# EAGLE schematic Lamp Logic Board_11 (EAGLE 9.5.0)

## Sheet 1 of 4
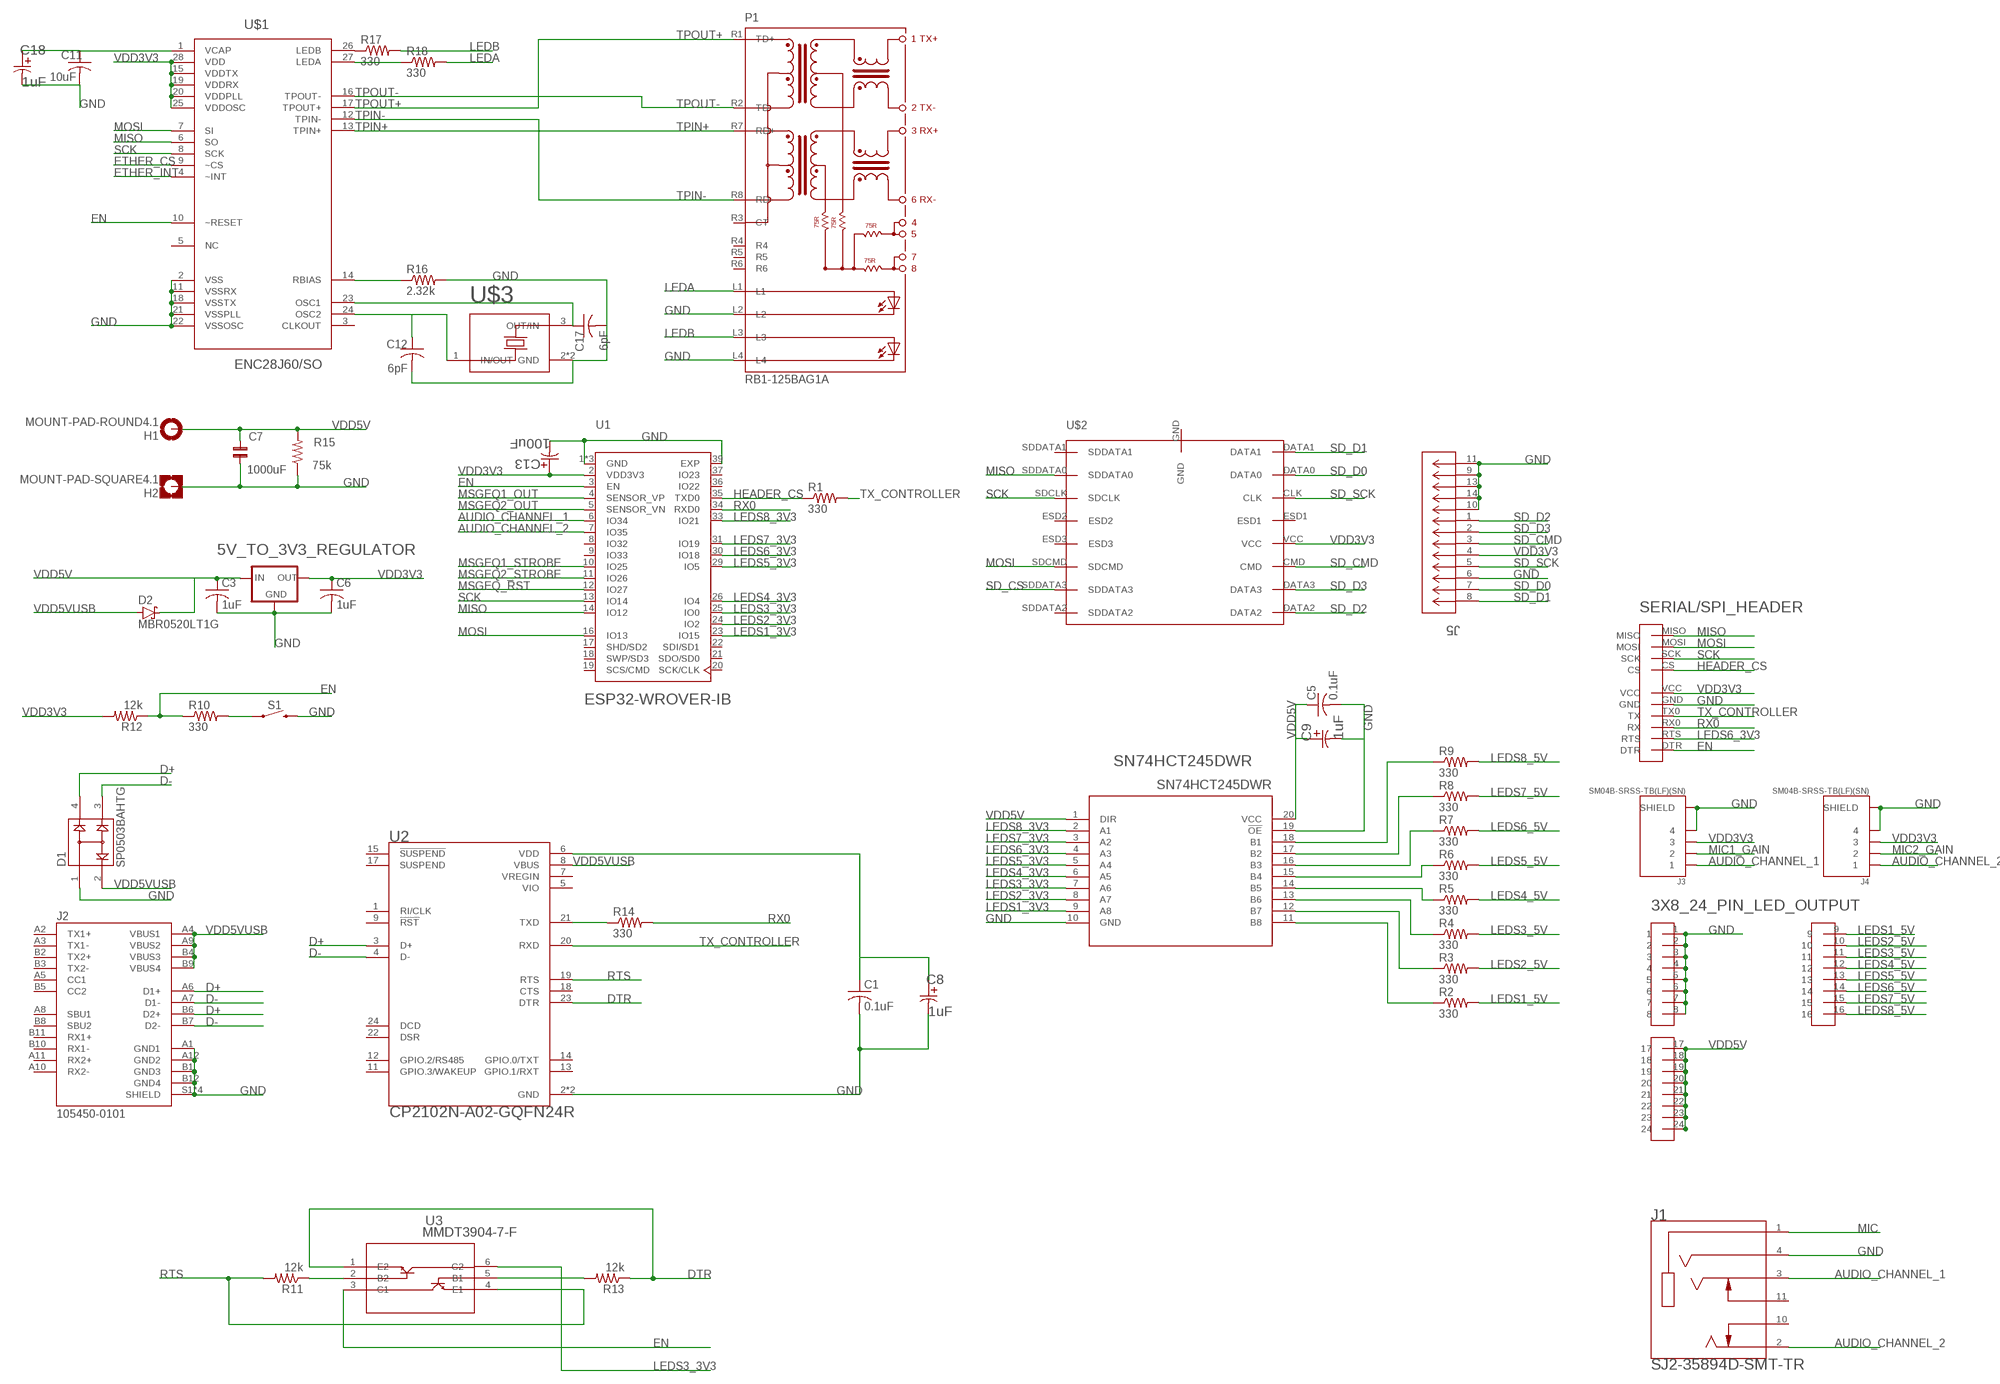
[diagram p0: schematic, sheet 1]

### Parts
3X8_24_PIN_LED_OUTPUT  3X8PINHEAD  [3X8PINHEAD]
5V_TO_3V3_REGULATOR  LM1117MP-1.8  [SOT223]
C1  0.1uF  C-USC0402  [C0402]
C3  1uF  C-USC0402  [C0402]
C5  0.1uF  C-USC0805  [C0805]
C6  1uF  C-USC0402  [C0402]
C7  1000uF  C-BP-2,0X5  [ENP2,0-5]
C8  1uF  EEEFC1V1R0R  [CAP_EEFC_B]
C9  1uF  EEEFC1V1R0R  [CAP_EEFC_B]
C11  10uF  C-USC0402  [C0402]
C12  6pF  C-USC0402  [C0402]
C13  100uF  EEEFC1V1R0R  [CAP_EEFC_B]
C17  6pF  C-USC0402  [C0402]
C18  1uF  EEEFC1V1R0R  [CAP_EEFC_B]
D1  SP0503BAHTG  [SOT143]
D2  MBR0520LT1G  [SOD-123]
H1  MOUNT-PAD-ROUND4.1  [4,1-PAD]
H2  MOUNT-PAD-SQUARE4.1  [4,1-PAD-SQUARE]
J1  SJ2-35894D-SMT-TR  [CUI_SJ2-35894D-SMT-TR]
J2  105450-0101  [MOLEX_105450-0101]
J3  SM04B-SRSS-TB(LF)(SN)  [JST_SM04B-SRSS-TB(LF)(SN)]
J4  SM04B-SRSS-TB(LF)(SN)  [JST_SM04B-SRSS-TB(LF)(SN)]
J5  LLC  [CON00218_8]
P1  RB1-125BAG1A  [WIZNET_RB1-125BAG1A]
R1  330  R-US_R1206  [R1206]
R2  330  R-US_R1206  [R1206]
R3  330  R-US_R1206  [R1206]
R4  330  R-US_R1206  [R1206]
R5  330  R-US_R1206  [R1206]
R6  330  R-US_R1206  [R1206]
R7  330  R-US_R1206  [R1206]
R8  330  R-US_R1206  [R1206]
R9  330  R-US_R1206  [R1206]
R10  330  R-US_R1206  [R1206]
R11  12k  R-US_R1206  [R1206]
R12  12k  R-US_R1206  [R1206]
R13  12k  R-US_R1206  [R1206]
R14  330  R-US_R1206  [R1206]
R15  75k  R-US_0309/12  [0309/12]
R16  2.32k  R-US_R1206  [R1206]
R17  330  R-US_R1206  [R1206]
R18  330  R-US_R1206  [R1206]
S1  MOMENTARY-SWITCH-SPST-SMD-6.0X3.5MM  [TACTILE_SWITCH_SMD_6.0X3.5MM]
SERIAL/SPI_HEADER  2X6PINHEAD  [2X6PINHEAD]
SN74HCT245DWR  SN74HCT245DWR  [DW20]
U1  ESP32-WROVER-IB  ESP32-WROVER-I  [XCVR_ESP32-WROVER-I]
U2  CP2102N-A02-GQFN24R  [SILABS_CP2102N-A02-GQFN24R]
U3  MMDT3904-7-F  [SOT-363]
U$1  ENC28J60/SO  [SOIC127P1034X264-28N]
U$2  CM1624-08DE  [CM1624-08DE]
U$3  ECS-250-10-37B-CTN-TR  [ECS-250-10-37B-CTN-TR]

### Nets
AUDIO_CHANNEL_1: J1.3(RING1) J3.1 U1.6(IO34)
AUDIO_CHANNEL_2: J1.2(TIP) J4.1 U1.7(IO35)
D+: D1.4 J2.A6(D1+) J2.B6(D2+) U2.3(D+)
D-: D1.3 J2.A7(D1-) J2.B7(D2-) U2.4(D-)
DTR: R13.1 U2.23(DTR) U3.1(E2)
EN: R10.1 R12.1 SERIAL/SPI_HEADER.DTR U1.3(EN) U3.3(C1) U$1.10(~RESET)
ETHER_CS: U$1.9(~CS)
ETHER_INT: U$1.4(~INT)
GND: 3X8_24_PIN_LED_OUTPUT.1 3X8_24_PIN_LED_OUTPUT.2 3X8_24_PIN_LED_OUTPUT.3 3X8_24_PIN_LED_OUTPUT.4 3X8_24_PIN_LED_OUTPUT.5 3X8_24_PIN_LED_OUTPUT.6 3X8_24_PIN_LED_OUTPUT.7 3X8_24_PIN_LED_OUTPUT.8 5V_TO_3V3_REGULATOR.1(GND) C1.2 C3.2 C5.2 C6.2 C7.1 C8.2 C9.2 C11.2 C12.2 C13.2 C17.2 C18.2 D1.1 H2.B4,1(MOUNT) J1.4(RING2) J2.A1(GND1) J2.A12(GND2) J2.B1(GND3) J2.B12(GND4) J2.S1(SHIELD) J2.S2(SHIELD) J2.S3(SHIELD) J2.S4(SHIELD) J3.4 J3.S1(SHIELD) J3.S2(SHIELD) J4.4 J4.S1(SHIELD) J4.S2(SHIELD) J5.6 J5.9 J5.10 J5.11 J5.13 J5.14 P1.L2 P1.L4 R15.1 R16.2 S1.2 SERIAL/SPI_HEADER.GND SN74HCT245DWR.10(GND) SN74HCT245DWR.19(!OE) U1.1(GND) U1.15(GND) U1.38(GND) U1.39(EXP) U2.2(GND) U2.25(GND) U$1.2(VSS) U$1.11(VSSRX) U$1.18(VSSTX) U$1.21(VSSPLL) U$1.22(VSSOSC) U$3.2(GND) U$3.4(GND)
HEADER_CS: R1.1 SERIAL/SPI_HEADER.CS U1.35(TXD0)
LEDA: P1.L1 R18.2
LEDB: P1.L3 R17.2
LEDS1_3V3: SN74HCT245DWR.9(A8) U1.23(IO15)
LEDS1_5V: 3X8_24_PIN_LED_OUTPUT.9 R2.2
LEDS2_3V3: SN74HCT245DWR.8(A7) U1.24(IO2)
LEDS2_5V: 3X8_24_PIN_LED_OUTPUT.10 R3.2
LEDS3_3V3: SN74HCT245DWR.7(A6) U1.25(IO0) U3.6(C2)
LEDS3_5V: 3X8_24_PIN_LED_OUTPUT.11 R4.2
LEDS4_3V3: SN74HCT245DWR.6(A5) U1.26(IO4)
LEDS4_5V: 3X8_24_PIN_LED_OUTPUT.12 R5.2
LEDS5_3V3: SN74HCT245DWR.5(A4) U1.29(IO5)
LEDS5_5V: 3X8_24_PIN_LED_OUTPUT.13 R6.2
LEDS6_3V3: SERIAL/SPI_HEADER.RTS SN74HCT245DWR.4(A3) U1.30(IO18)
LEDS6_5V: 3X8_24_PIN_LED_OUTPUT.14 R7.2
LEDS7_3V3: SN74HCT245DWR.3(A2) U1.31(IO19)
LEDS7_5V: 3X8_24_PIN_LED_OUTPUT.15 R8.2
LEDS8_3V3: SN74HCT245DWR.2(A1) U1.33(IO21)
LEDS8_5V: 3X8_24_PIN_LED_OUTPUT.16 R9.2
MIC: J1.1(SLEEVE)
MIC1_GAIN: J3.2
MIC2_GAIN: J4.2
MISO: SERIAL/SPI_HEADER.MISO U1.14(IO12) U$1.6(SO) U$2.SDDATA0
MOSI: SERIAL/SPI_HEADER.MOSI U1.16(IO13) U$1.7(SI) U$2.SDCMD
MSGEQ1_OUT: U1.4(SENSOR_VP)
MSGEQ1_STROBE: U1.10(IO25)
MSGEQ2_OUT: U1.5(SENSOR_VN)
MSGEQ2_STROBE: U1.11(IO26)
MSGEQ_RST: U1.12(IO27)
N$1: R9.1 SN74HCT245DWR.18(B1)
N$5: C1.1 C8.1 U2.6(VDD)
N$6: R8.1 SN74HCT245DWR.17(B2)
N$7: R11.1 U3.2(B2)
N$8: R13.2 U3.5(B1)
N$9: R10.2 S1.1
N$10: R7.1 SN74HCT245DWR.16(B3)
N$11: R6.1 SN74HCT245DWR.15(B4)
N$12: R5.1 SN74HCT245DWR.14(B5)
N$13: R4.1 SN74HCT245DWR.13(B6)
N$14: R3.1 SN74HCT245DWR.12(B7)
N$15: R2.1 SN74HCT245DWR.11(B8)
N$18: R14.1 U2.21(TXD)
N$19: C11.1 C18.1 U$1.1(VCAP)
N$20: R16.1 U$1.14(RBIAS)
N$21: C12.1 U$1.24(OSC2) U$3.1(IN/OUT)
N$22: C17.1 U$1.23(OSC1) U$3.3(OUT/IN)
N$23: R17.1 U$1.26(LEDB)
N$25: R18.1 U$1.27(LEDA)
RTS: R11.2 U2.19(RTS) U3.4(E1)
RX0: R14.2 SERIAL/SPI_HEADER.RX0(RX) U1.34(RXD0)
SCK: SERIAL/SPI_HEADER.SCK U1.13(IO14) U$1.8(SCK) U$2.SDCLK
SD_CMD: J5.3 U$2.CMD
SD_CS: U$2.SDDATA3
SD_D0: J5.7 U$2.DATA0
SD_D1: J5.8 U$2.DATA1
SD_D2: J5.1 U$2.DATA2
SD_D3: J5.2 U$2.DATA3
SD_SCK: J5.5 U$2.CLK
TPIN+: P1.R7(RD+) U$1.13(TPIN+)
TPIN-: P1.R8(RD-) U$1.12(TPIN-)
TPOUT+: P1.R1(TD+) U$1.17(TPOUT+)
TPOUT-: P1.R2(TD-) U$1.16(TPOUT-)
TX_CONTROLLER: R1.2 SERIAL/SPI_HEADER.TX0(TX) U2.20(RXD)
VDD3V3: 5V_TO_3V3_REGULATOR.2(OUT) 5V_TO_3V3_REGULATOR.4(OUT) C6.1 C13.1 J3.3 J4.3 J5.4 R12.2 SERIAL/SPI_HEADER.VCC U1.2(VDD3V3) U$1.15(VDDTX) U$1.19(VDDRX) U$1.20(VDDPLL) U$1.25(VDDOSC) U$1.28(VDD) U$2.VCC
VDD5V: 3X8_24_PIN_LED_OUTPUT.17 3X8_24_PIN_LED_OUTPUT.18 3X8_24_PIN_LED_OUTPUT.19 3X8_24_PIN_LED_OUTPUT.20 3X8_24_PIN_LED_OUTPUT.21 3X8_24_PIN_LED_OUTPUT.22 3X8_24_PIN_LED_OUTPUT.23 3X8_24_PIN_LED_OUTPUT.24 5V_TO_3V3_REGULATOR.3(IN) C3.1 C5.1 C7.2 C9.1 D2.C H1.B4,1(MOUNT) R15.2 SN74HCT245DWR.1(DIR) SN74HCT245DWR.20(VCC)
VDD5VUSB: D1.2 D2.A J2.A4(VBUS1) J2.A9(VBUS2) J2.B4(VBUS3) J2.B9(VBUS4) U2.8(VBUS)
Unconnected: J1.10(TIP_SWITCH) J1.11(RING1_SWITCH) J2.A2(TX1+) J2.A3(TX1-) J2.A5(CC1) J2.A8(SBU1) J2.A10(RX2-) J2.A11(RX2+) J2.B2(TX2+) J2.B3(TX2-) J2.B5(CC2) J2.B8(SBU2) J2.B10(RX1-) J2.B11(RX1+) P1.R3(CT) P1.R4 P1.R5 P1.R6 U1.8(IO32) U1.9(IO33) U1.17(SHD/SD2) U1.18(SWP/SD3) U1.19(SCS/CMD) U1.20(SCK/CLK) U1.21(SDO/SD0) U1.22(SDI/SD1) U1.36(IO22) U1.37(IO23) U2.1(RI/CLK) U2.5(VIO) U2.9(!RST) U2.11(GPIO.3/WAKEUP) U2.12(GPIO.2/RS485) U2.13(GPIO.1/RXT) U2.14(GPIO.0/TXT) U2.15(!SUSPEND) U2.17(SUSPEND) U2.18(CTS) U2.22(DSR) U2.24(DCD) U$1.3(CLKOUT) U$1.5(NC) U$2.ESD1 U$2.ESD2 U$2.ESD3 U$2.GND U$2.SDDATA1 U$2.SDDATA2

## Sheet 2 of 4

## Sheet 3 of 4

## Sheet 4 of 4

## Power pins joined to a net without a drawn wire
VREGIN: U2.7(VREGIN)

## Library data of the parts
3X8_24_PIN_LED_OUTPUT = 3X8PINHEAD:3X8PINHEAD
5V_TO_3V3_REGULATOR = lm1117:LM1117?-*: 800mA Low-Dropout Linear Regulator Source: http://ww1.microchip.com/downloads/en/DeviceDoc/39760d.pdf; MF: Texas Instruments; MPN: LM1117MP-1.8; OC_FARNELL: 1469053; OC_NEWARK: 41K3467
C1 C3 C5 C6 C11 C12 C17 = resistor:C-US: CAPACITOR, American symbol
C7 = cap-pan40:C-BP: BIPOLAR ELECTROLYTIC
C8 C9 C13 C18 = EEE-FC1V1R0R:EEEFC1V1R0R; MANUFACTURER_PART_NUMBER: EEEFC1V1R0R; VENDOR: Panasonic
D1 = SP0503BAHTG:SP0503BAHTG: TVS DIODE 5.5VWM 8.5VC SOT143; DESCRIPTION: SP050xBA Series 8 V 30 pF Uni-Directional SMT TVS Avalanche Diode Array SOT-143; DIGI-KEY_PART_NUMBER: F2715CT-ND; DIGI-KEY_PURCHASE_URL: https://www.digikey.com/product-detail/en/littelfuse-inc/SP0503BAHTG/F2715CT-ND/1154322?utm_source=snapeda&utm_medium=aggregator&utm_campaign=symbol; MF: Littelfuse Inc.; MP: SP0503BAHTG; PACKAGE: SOT-143 Littelfuse
D2 = Diodes:MBR0520LT1G: DIODE SCHOTTKY 20V 500MA SOD123 Manufacturer's datasheet <https://www.onsemi.com/pub/Collateral/MBR0520LT1-D.PDF>; CREATED_BY: PCBLayout.com; DIGIKEY_PART_NUMBER: MBR0520LT1GOSTR-ND; MANUFACTURER: ON Semiconductor; MPN: MBR0520LT1G; PACKAGE: SOD-123
H1 = holes:MOUNT-PAD-ROUND: MOUNTING PAD, round
H2 = holes:MOUNT-PAD-SQUARE: MOUNTING PAD, square
J1 = SJ2-35894D-SMT-TR:SJ2-35894D-SMT-TR: 4 conductors, 3.5mm, SMT Audio Jack w/ 2 Switch; CUI_PURCHASE_URL: https://www.cui.com/product/interconnect/connectors/audio-connectors/jacks/sj2-3589x-smt-series?utm_source=snapeda.com&utm_medium=referral&utm_campaign=snapedaBOM; DESCRIPTION: 3.5 mm, Stereo, Right Angle, Surface Mount _SMT_, Audio Jack Connector; DIGI-KEY_PART_NUMBER: CP-SJ2-35894D-SMT-CT-ND; DIGI-KEY_PURCHASE_URL: https://www.digikey.com/product-detail/en/cui-inc/SJ2-35894D-SMT-TR/CP-SJ2-35894D-SMT-CT-ND/6619623?utm_source=snapeda&utm_medium=aggregator&utm_campaign=symbol; MF: CUI Inc.; MP: SJ2-35894D-SMT-TR; PACKAGE: None
J2 = 105450-0101:105450-0101: USB Shielded I/O Receptacle; Type C; Right Angle; Surface Mount; Gold over Nickel; DESCRIPTION: USB Shielded I/O Receptacle; Type C; Right Angle; Surface Mount; Gold over Nickel; DIGI-KEY_PART_NUMBER: WM12856CT-ND; DIGI-KEY_PURCHASE_URL: https://www.digikey.com/product-detail/en/molex/1054500101/WM12856CT-ND/5843891?utm_source=snapeda&utm_medium=aggregator&utm_campaign=symbol; MF: Molex; MP: 1054500101; PACKAGE: None
J3 J4 = SM04B-SRSS-TB_LF__SN_:SM04B-SRSS-TB(LF)(SN): SH Series 1.0 mm Pitch 2 Position Single Row Side Entry Shrouded Header; AVAILABILITY: Unavailable; DESCRIPTION: SH Series 1.0 mm Pitch 2 Position Single Row Side Entry Shrouded Header; MF: JST Sales; MP: SM04B-SRSS-TB_LF__SN_; PACKAGE: None; PRICE: None
J5 = 5027740891:LLC; MANUFACTURER_PART_NUMBER: LLC; VENDOR: Molex Connector Corporation
P1 = RB1-125BAG1A:RB1-125BAG1A: Accessory RJ-45 With Transformer Connector - UDE; AVAILABILITY: Unavailable; DESCRIPTION: Accessory RJ-45 With Transformer Connector - UDE; MF: WIZnet; MP: RB1-125BAG1A; PACKAGE: HVQFN-36 NXP Semiconductors; PRICE: None
R1-R18 = resistor:R-US_: RESISTOR, American symbol
S1 = SparkFun-Switches:MOMENTARY-SWITCH-SPST: Momentary Switch (Pushbutton) - SPST Normally-open (NO) SPST momentary switches (buttons, pushbuttons). Variants PTH-12MM - 12mm square, through-hole Momentary Pushbutton Switch - 12mm Square <https://www.sparkfun.com/products/9190> (COM-09190) PTH-6.0MM, PTH-6.0MM-KIT - 6.0mm square, through-hole Mini Pushbutton Switch <https://www.sparkfun.com/products/97> (COM-00097) KIT package intended for soldering kit's - only one side of pads' copper is exposed. PTH-RIGHT-ANGLE-KIT - Right-angle, through-hole Right Angle Tactile Button <https://www.sparkfun.com/products/10791> - Used on SparkFun BigTime Watch Kit <https://www.sparkfun.com/products/11734> SMD-12MM - 12mm square, surface-mount Tactile Button - SMD (12mm) <https://www.sparkfun.com/products/12993> (COM-12993) Used on SparkFun PicoBoard <https://www.sparkfun.com/products/11888> SMD-4.5MM - 4.5mm Square Trackball Switch Used on SparkFun Blackberry Trackballer Breakout <https://www.sparkfun.com/products/13169> SMD-4.6MMX2.8MM - 4.60mm x 2.80mm, surface mount Used on SparkFun SAMD21 Mini Breakout <https://www.sparkfun.com/products/13664> SMD-5.2MM, SMD-5.2-REDUNDANT - 5.2mm square, surface-mount Mini Pushbutton Switch - SMD <https://www.sparkfun.com/products/8720> (COM-08720) Used on Arduino Pro Mini <https://www.sparkfun.com/products/11114> REDUNDANT package connects both switch circuits together SMD-6.0X3.5MM - 6.0 x 3.5mm, surface mount Momentary Reset Switch SMD <https://www.sparkfun.com/products/8229> (COM-08229) SMD-6.2MM-TALL - 6.2mm square, surface mount Tactile Button - SMD (6mm) <https://www.sparkfun.com/products/12992> Used on SparkFun Digital Sandbox <https://www.sparkfun.com/products/12651> SMD-RIGHT-ANGLE - Right-angle, surface mount Used on SparkFun Block for Intel® Edison - Arduino <https://www.sparkfun.com/products/13036>; PROD_ID: SWCH-00815; SF_SKU: COM-08229
SERIAL/SPI_HEADER = 2X4PINHEAD:2X6PINHEAD
SN74HCT245DWR = SN74HCT245DWR :SN74HCT245DWR; MANUFACTURER_PART_NUMBER: SN74HCT245DWR; VENDOR: Texas Instruments
U1 = ESP32-WROVER-I:ESP32-WROVER-I: Module: combo; GPIO, I2C x2, I2S x2, SDIO, SPI x3, UART x3; U.FL; AVAILABILITY: Unavailable; DESCRIPTION: Module: combo; GPIO, I2C x2, I2S x2, SDIO, SPI x3, UART x3; U.FL; MF: Espressif Systems; MP: ESP32-WROVER-I; PACKAGE: Module Espressif Systems; PRICE: None
U2 = CP2102N-A02-GQFN20R:CP2102N-A02-GQFN24R: IC USB TO UART BRIDGE QFN20
U3 = MMDT3904:MMDT3904-7-F; MANUFACTURER_PART_NUMBER: MMDT39047F; VENDOR: Diodes Inc
U$1 = ENC28J60_SO:ENC28J60/SO: Stand-Alone Ethernet Controller;; DESCRIPTION: ENC28J60 Series 3.3 V Stand-Alone Ethernet Controller with SPI Interface-SSOP-28; DIGI-KEY_PART_NUMBER: ENC28J60/SS-ND; DIGI-KEY_PURCHASE_URL: https://www.digikey.com/product-detail/en/microchip-technology/ENC28J60-SS/ENC28J60-SS-ND/857584?utm_source=snapeda&utm_medium=aggregator&utm_campaign=symbol; MF: Microchip; MP: ENC28J60/SS; PACKAGE: SSOP-28 Microchip
U$2 = CM1624-08DE:CM1624-08DE
U$3 = ECS-250-10-37B-CTN-TR:ECS-250-10-37B-CTN-TR